# Altium schematic sheet Circuit diagram of speed sensor.SchDoc
size A4
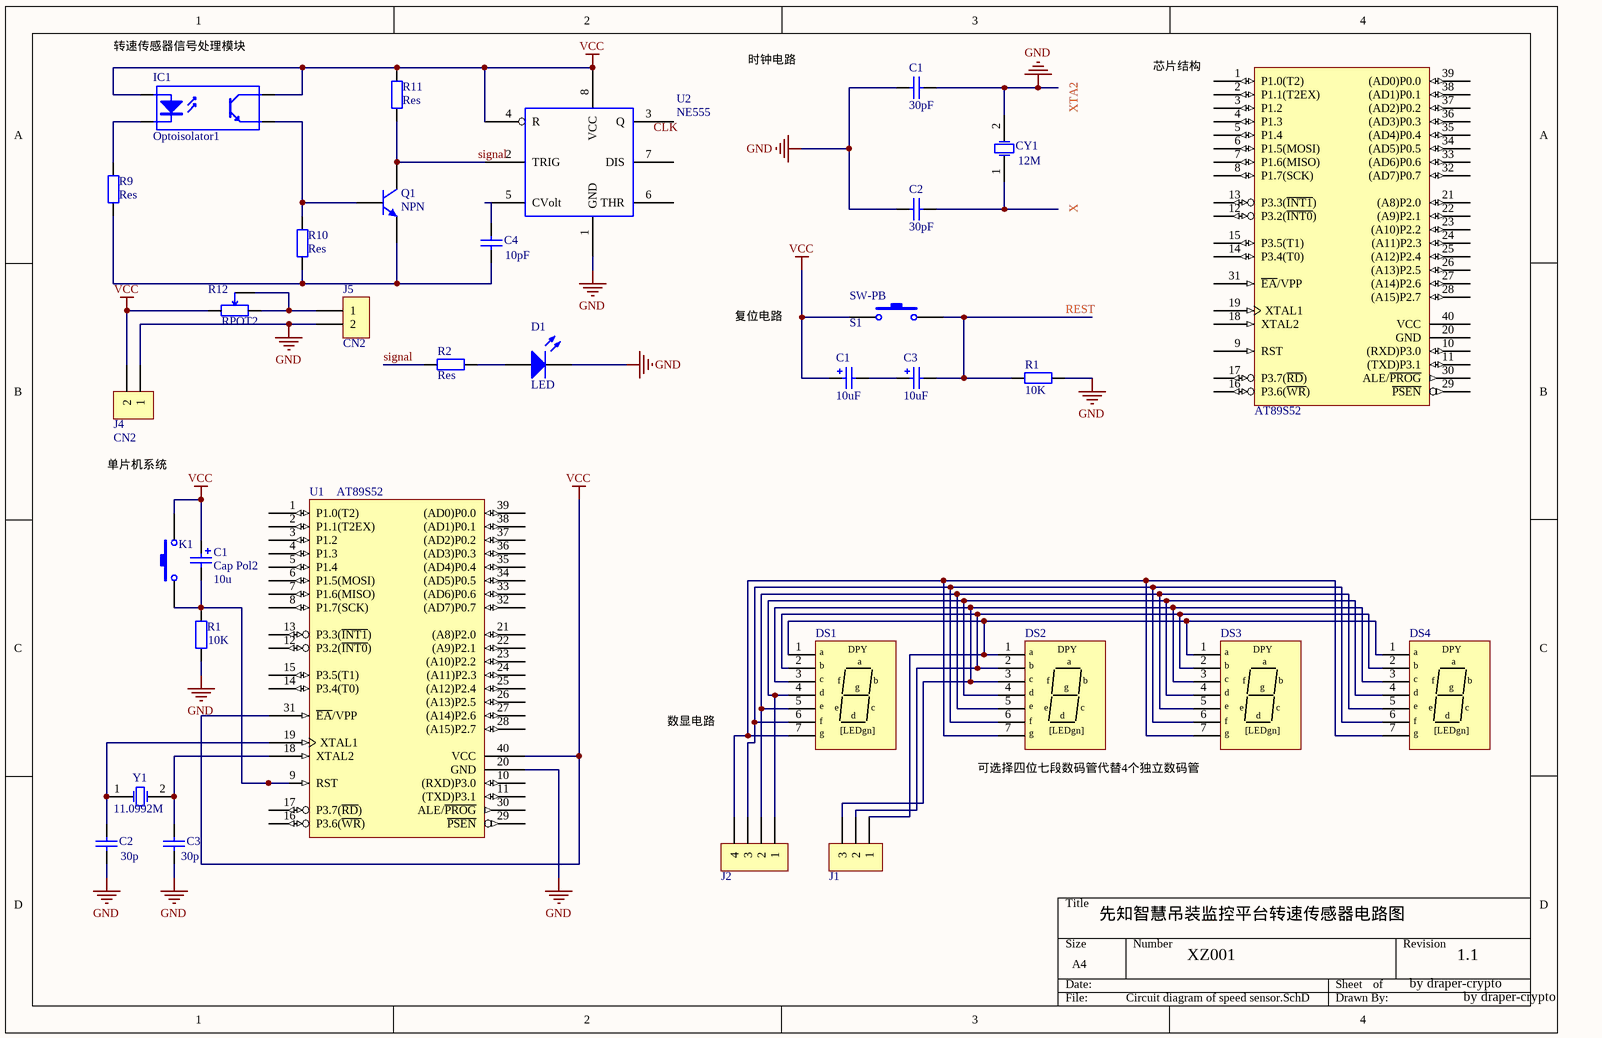
[diagram p0: Circuit diagram of speed sensor.SchDoc]

## Parts
(Parts that share a designator on the sheet are numbered #1, #2 ... from top to bottom, then left to right.)
C1#1  value 30pF  [C1206]  (hidden comment: Cap Semi)
C1#2  value 10uF  [POLAR0.8]
C1#3  Cap Pol2  value 10u  [POLAR0.8]
C2#1  value 30pF  [C1206]  (hidden comment: Cap Semi)
C2#2  value 30p  [RAD-0.3]  (hidden comment: Cap)
C3#1  value 10uF  [POLAR0.8]
C3#2  value 30p  [RAD-0.3]  (hidden comment: Cap)
C4  value 10pF  [RAD-0.3]
CY1  V: 12M  [R38]
D1  LED  [LED-0]
DS1  DPY_7-SEG  (value not drawn)
DS2  DPY_7-SEG  (value not drawn)
DS3  DPY_7-SEG  (value not drawn)
DS4  DPY_7-SEG  (value not drawn)
IC1  Optoisolator1  [DIP-4]
J1  SIP3  [SIP3-2.0]  (value not drawn)
J2  SIP4  [SIP4-2.0]  (value not drawn)
J4  CN2
J5  CN2
K1  SW-PB  [SPST-2]  (value not drawn)
Q1  NPN  [TO-226-AA]
R1#1  V: 10K  [AXIAL-0.4]  (hidden comment: res)
R1#2  value 10K  [AXIAL-0.4]  (hidden comment: Res2)
R2  Res  [AXIAL-0.4]
R9  Res  [AXIAL-0.4]
R10  Res  [AXIAL-0.4]
R11  Res  [AXIAL-0.4]
R12  RPOT2
S1  SW-PB  [SPST-2]
U1  AT89S52  [DIP-40]
U2  NE555  [DIP-8]
U?  AT89S52  [DIP-40]
Y1  V: 11.0992M  [R38]

## Nets
GND: C1#1.1 C1#1.2 C2#1.1 C2#2.1 C3#2.1 CY1.2(OSC2) D1.2(K) J4.1 J5.2 R1#1.1 R1#2.1 U1.20(GND) U2.1(GND)
VCC: C1#2.1 C1#3.1 IC1.1(A) IC1.4(C) J4.2 K1.2 R11.1 R12.?1 S1.1 U1.31(~{EA}/VPP) U1.40(VCC) U2.4(R) U2.8(VCC)
REST: C3#1.2 R1#1.2 S1.2
signal: Q1.1(C) R2.2 R11.2 U2.2(TRIG)
NetC1#2_2: C1#2.2 C3#1.1
NetC1#3_2: C1#3.2 K1.1 R1#2.2 U1.9(RST)
NetC2#1_2: C2#1.2 CY1.1(OSC1)
NetC2#2_2: C2#2.2 U1.19(XTAL1) Y1.1(OSC1)
NetC3#2_2: C3#2.2 U1.18(XTAL2) Y1.2(OSC2)
NetC4_1: C4.1 Q1.3(E) R9.1 R10.2
NetC4_2: C4.2 U2.5(CVolt)
NetD1_1: D1.1(A) R2.1
NetDS1_1: DS1.1(a) DS2.1(a) DS3.1(a) DS4.1(a) J1.1
NetDS1_2: DS1.2(b) DS2.2(b) DS3.2(b) DS4.2(b) J1.2
NetDS1_3: DS1.3(c) DS2.3(c) DS3.3(c) DS4.3(c) J1.3
NetDS1_4: DS1.4(d) DS2.4(d) DS3.4(d) DS4.4(d) J2.1
NetDS1_5: DS1.5(e) DS2.5(e) DS3.5(e) DS4.5(e) J2.2
NetDS1_6: DS1.6(f) DS2.6(f) DS3.6(f) DS4.6(f) J2.3
NetDS1_7: DS1.7(g) DS2.7(g) DS3.7(g) DS4.7(g) J2.4
NetIC1_2: IC1.2(K) R9.2
NetIC1_3: IC1.3(E) Q1.2(B) R10.1
NetJ5_1: J5.1 R12.?2 R12.?3

Not connected (* = marked no-connect by the designer): U1 1(P1.0(T2)) 2(P1.1(T2EX)) 3(P1.2) 4(P1.3) 5(P1.4) 6(P1.5(MOSI)) 7(P1.6(MISO)) 8(P1.7(SCK)) 10((RXD)P3.0) 11((TXD)P3.1) 12(P3.2(~{INT0})) 13(P3.3(~{INT1})) 14(P3.4(T0)) 15(P3.5(T1)) 16(P3.6(~{WR})) 17(P3.7(~{RD})) 21((A8)P2.0) 22((A9)P2.1) 23((A10)P2.2) 24((A11)P2.3) 25((A12)P2.4) 26((A13)P2.5) 27((A14)P2.6) 28((A15)P2.7) 29(~{PSEN}) 30(ALE/~{PROG}) 32((AD7)P0.7) 33((AD6)P0.6) 34((AD5)P0.5) 35((AD4)P0.4) 36((AD3)P0.3) 37((AD2)P0.2) 38((AD1)P0.1) 39((AD0)P0.0); U2 3(Q) 6(THR) 7(DIS); U? 1(P1.0(T2)) 2(P1.1(T2EX)) 3(P1.2) 4(P1.3) 5(P1.4) 6(P1.5(MOSI)) 7(P1.6(MISO)) 8(P1.7(SCK)) 9(RST) 10((RXD)P3.0) 11((TXD)P3.1) 12(P3.2(~{INT0})) 13(P3.3(~{INT1})) 14(P3.4(T0)) 15(P3.5(T1)) 16(P3.6(~{WR})) 17(P3.7(~{RD})) 18(XTAL2) 19(XTAL1) 20(GND) 21((A8)P2.0) 22((A9)P2.1) 23((A10)P2.2) 24((A11)P2.3) 25((A12)P2.4) 26((A13)P2.5) 27((A14)P2.6) 28((A15)P2.7) 29(~{PSEN}) 30(ALE/~{PROG}) 31(~{EA}/VPP) 32((AD7)P0.7) 33((AD6)P0.6) 34((AD5)P0.5) 35((AD4)P0.4) 36((AD3)P0.3) 37((AD2)P0.2) 38((AD1)P0.1) 39((AD0)P0.0) 40(VCC)

## Notes on the sheet
- Labels drawn without touching a wire or pin: 1.1, by draper-crypto, CLK, X, XTA2, XZ001, 先知智慧吊装监控平台转速传感器电路图, 单片机系统, 可选择四位七段数码管代替4个独立数码管, 复位电路, 数显电路, 时钟电路, 芯片结构, 转速传感器信号处理模块
- (in symbol DPY_7-SEG) DPY; [LEDgn]

## Library data of the parts
C1#1 C2#1 = Cap Semi: Capacitor (Semiconductor SIM Model); Published: 8-Jun-2000; LatestRevisionDate: 29-May-2009; LatestRevisionNote: IPC-7351 Footprint Added.; PackageReference: C1206; Publisher: Altium Limited; PackageDescription: Chip Capacitor
C1#2 C1#3 C3#1 = Cap Pol2: Polarized Capacitor (Axial); Published: 8-Jun-2000; LatestRevisionDate: 17-Jul-2002; LatestRevisionNote: Re-released for DXP Platform.; PackageReference: POLAR0.8; Publisher: Altium Limited; PackageDescription: Polarized Capacitor; 2 Leads
C2#2 C3#2 C4 = Cap: Capacitor; Published: 8-Jun-2000; LatestRevisionDate: 17-Jul-2002; LatestRevisionNote: Re-released for DXP Platform.; PackageReference: RAD-0.3; Publisher: Altium Limited; PackageDescription: Radial Cap, Thru-Hole; 2 Leads; 0.3 in Pin Spacing
CY1 Y1 = XTAL: Crystal Oscillator; Published: 8-Jun-2000; LatestRevisionDate: 17-Jul-2002; LatestRevisionNote: Re-released for DXP Platform.; PackageReference: R38; Publisher: Altium Limited; PackageDescription: Crystal, Thru-Hole; 2 Leads; Body 3.1 x 8.2 mm (Dia.xH)
D1 = LED0: Typical INFRARED GaAs LED; Published: 8-Jun-2000; LatestRevisionDate: 08-Jul-2005; LatestRevisionNote: Mech Layer 1 removed.; PackageReference: LED-0; Publisher: Altium Limited; PackageDescription: LED; 2 Leads
DS1-DS4 = DPY_7-SEG: Seven-Segment Display
IC1 = Optoisolator1: 4-Pin Phototransistor Optocoupler; Published: 24-Mar-1999; LatestRevisionDate: 04-Mar-2005; LatestRevisionNote: Sch pins 3 & 4 Swapped.; DatasheetVersion: Nov-2003; PackageReference: DIP-4; Publisher: Altium Limited
J1 = SIP3: jointbar
J2 = SIP4: jointbar
J4 J5 = CON2: Connector
K1 S1 = SW-PB: Switch; Published: 24-Mar-1999; LatestRevisionDate: 17-Jul-2002; LatestRevisionNote: Re-released for DXP Platform.; PackageReference: SPST-2; PackageDescription: Switch; 2 Leads
  K1: Publisher: Altium Limited
  S1: Publisher: SW-PB
Q1 = NPN: NPN Bipolar Transistor; Published: 8-Jun-2000; LatestRevisionDate: 17-Jul-2002; LatestRevisionNote: Re-released for DXP Platform.; PackageReference: TO-226-AA; Publisher: Altium Limited; PackageDescription: TO, Flat Index; 3 In-Line, Axial Leads; Body Dia. 4.8mm; Leads 0.55 x 0.51 mm (max); Code_JEDEC: TO-226-AA
R1#1 R1#2 R2 R9-R11 = Res2: Resistor; Published: 8-Jun-2000; LatestRevisionDate: 17-Jul-2002; LatestRevisionNote: Re-released for DXP Platform.; PackageReference: AXIAL-0.4; Publisher: Altium Limited; PackageDescription: Axial Device, Thru-Hole; 2 Leads; 0.4 in Pin Spacing
R12 = Component_1
U1 U? = AT89S52: 8-Bit Microcontroller with 8K ISP Flash ROM
U2 = 555